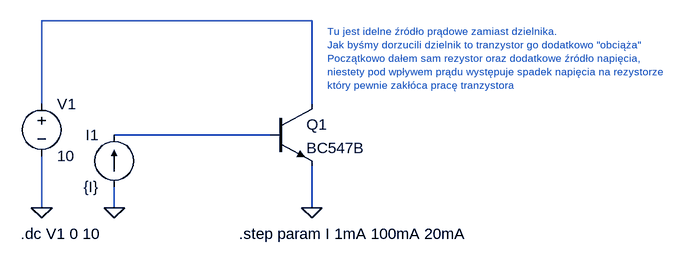
[diagram p0: schematic schemat.asc]
schemat.asc, the LTspice schematic file:
Version 4
SHEET 1 880 680
WIRE -224 -176 -640 -176
WIRE -640 -48 -640 -176
WIRE -224 -48 -224 -176
WIRE -288 0 -528 0
WIRE -640 112 -640 32
WIRE -528 112 -528 80
WIRE -224 112 -224 48
FLAG -640 112 0
FLAG -528 112 0
FLAG -224 112 0
SYMBOL voltage -640 -64 R0
WINDOW 123 24 124 Left 2
WINDOW 39 0 0 Left 0
SYMATTR InstName V1
SYMATTR Value 10
SYMBOL npn -288 -48 R0
SYMATTR InstName Q1
SYMATTR Value BC547B
SYMBOL current -528 80 R180
WINDOW 0 24 80 Left 2
WINDOW 3 24 0 Left 2
WINDOW 123 0 0 Left 0
WINDOW 39 0 0 Left 0
SYMATTR InstName I1
SYMATTR Value {I}
TEXT -672 152 Left 2 !.dc V1 0 10
TEXT -336 152 Left 2 !.step param I 1mA 100mA 20mA
TEXT -200 -160 Left 1 ;Tu jest idelne źródło prądowe zamiast dzielnika.\nJak byśmy dorzucili dzielnik to tranzystor go dodatkowo "obciąża"\nPoczątkowo dałem sam rezystor oraz dodatkowe źródło napięcia,\nniestety pod wpływem prądu występuje spadek napięcia na rezystorze\nktóry pewnie zakłóca pracę tranzystora

The netlist it stands for:
* schemat.asc
V1 N001 0 10
Q1 N001 N002 0 0 BC547B
I1 0 N002 {I}
.model NPN NPN
.model PNP PNP
.lib standard.bjt
.dc V1 0 10
.step param I 1mA 100mA 20mA
* Tu jest idelne źródło prądowe zamiast dzielnika.
* Jak byśmy dorzucili dzielnik to tranzystor go dodatkowo "obciąża"
* Początkowo dałem sam rezystor oraz dodatkowe źródło napięcia,
* niestety pod wpływem prądu występuje spadek napięcia na rezystorze
* który pewnie zakłóca pracę tranzystora
.backanno
.end